# Altium schematic sheet Control_Schem.SchDoc (part 5 of 5)
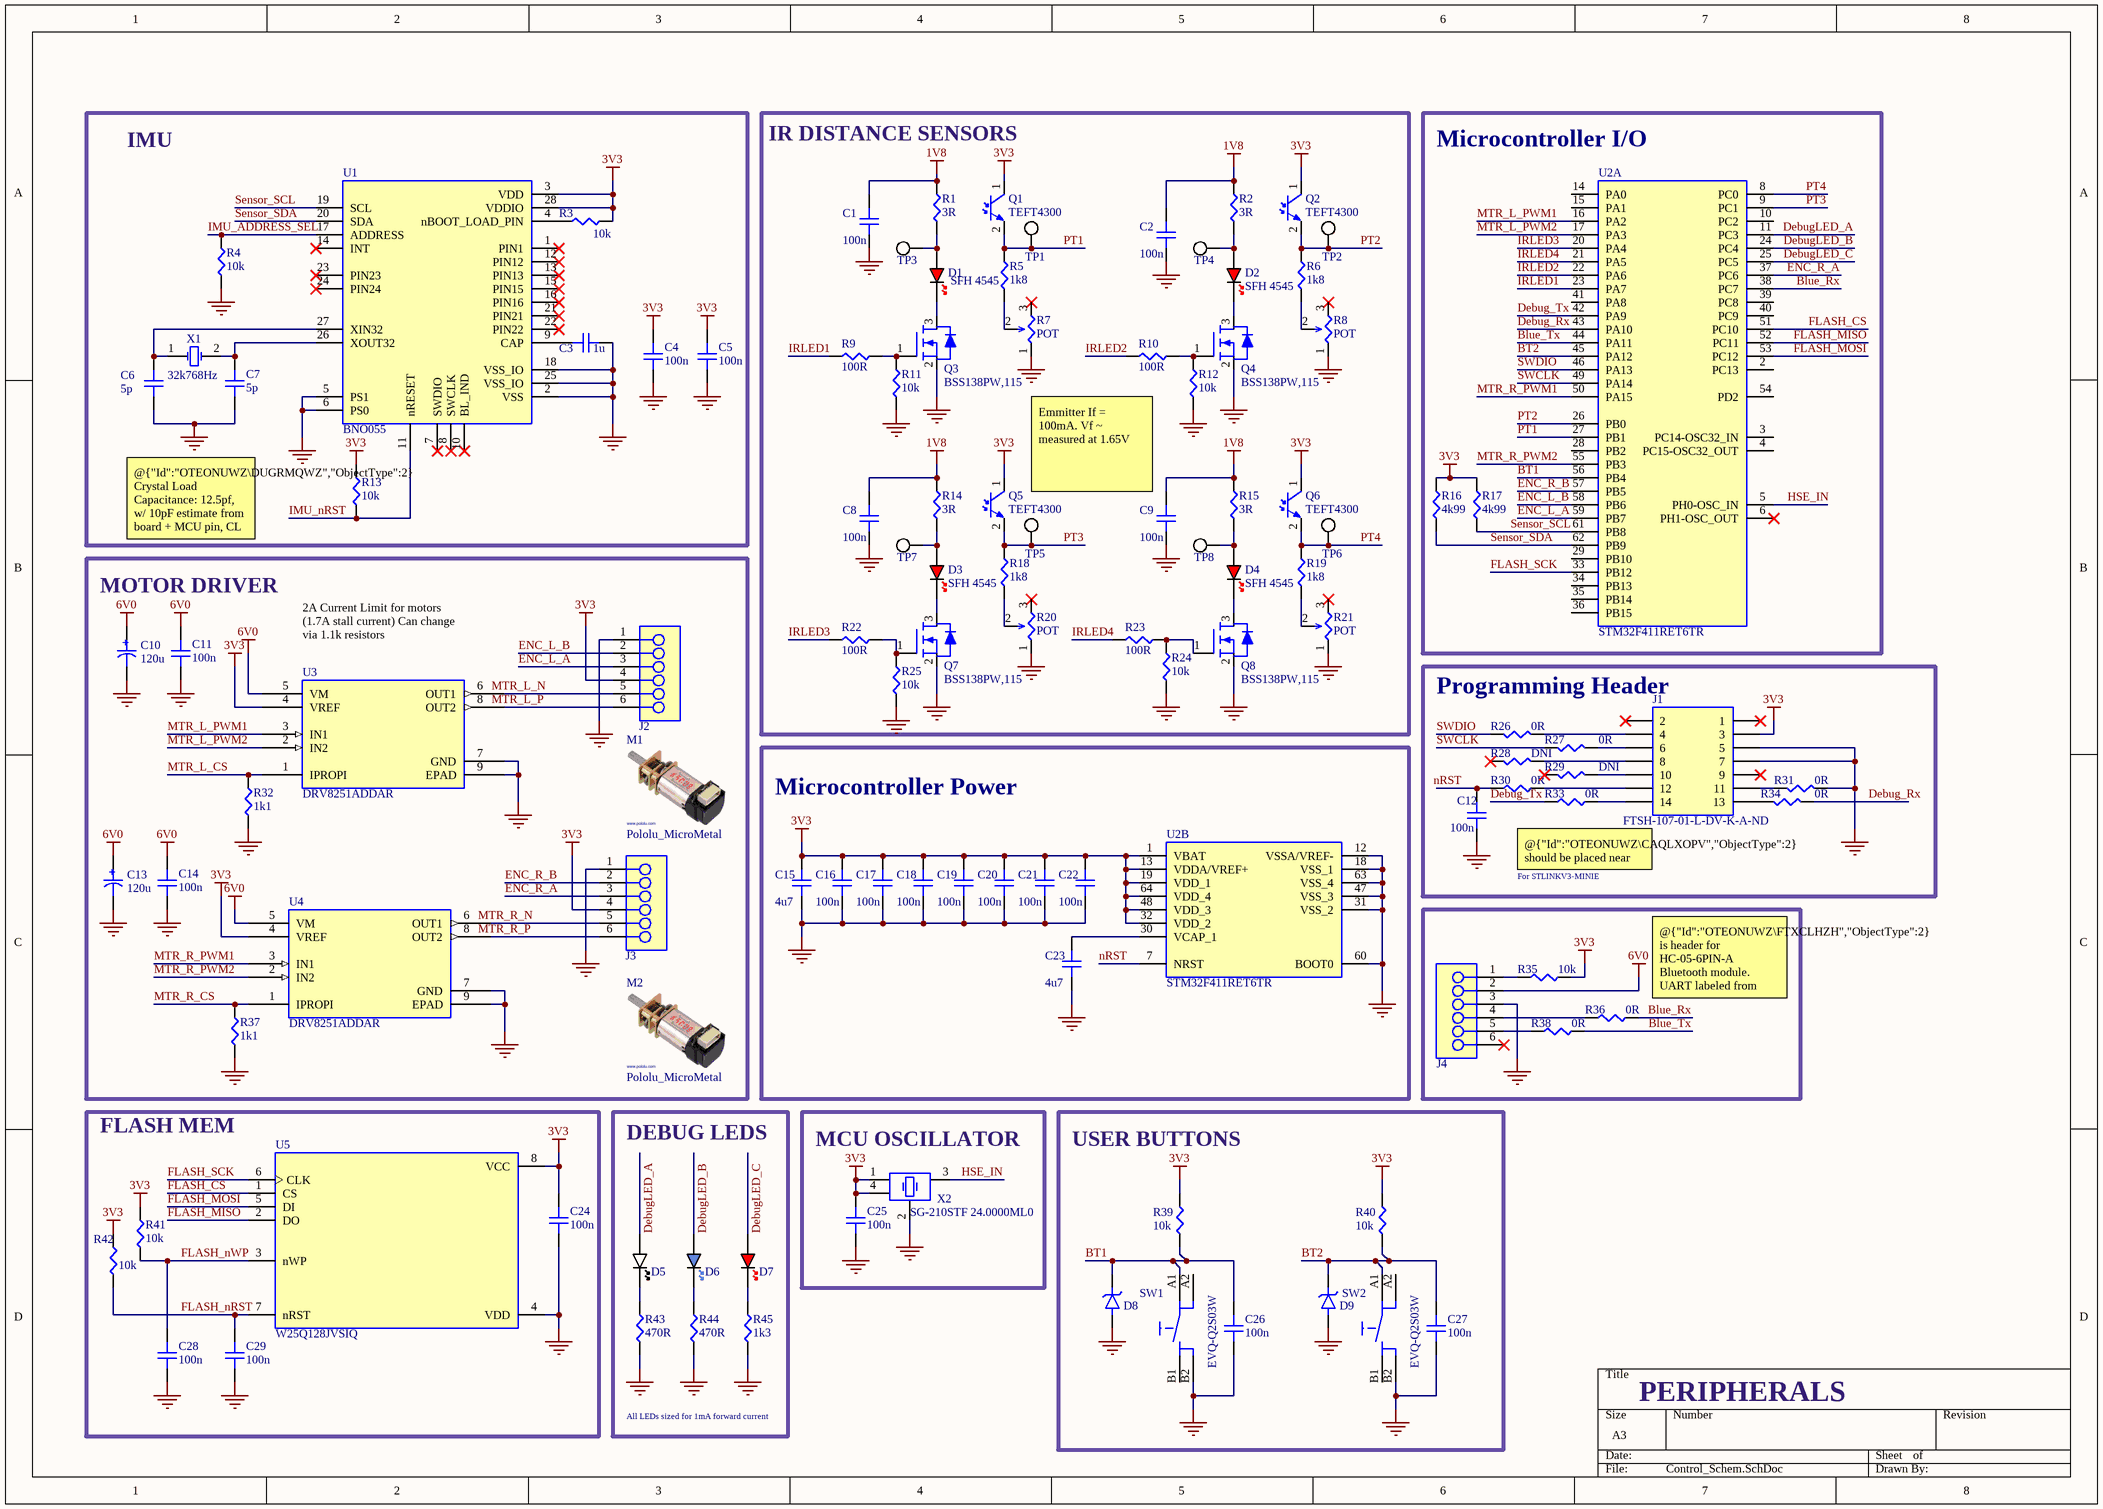
[diagram p4: Control_Schem.SchDoc]

## Library data of the parts (continued)
X2 = XTAL-4P: Oscillator XO 24MHz ±50ppm 15pF CMOS 55% 1.8V/2.5V/3.3V 4-Pin SMD T/R; Manufacturer: Epson; Fall Time: 3ns; Low Level Output Current: 6mA; Max Supply Current: 2.2mA; Max Supply Voltage: 3.3V; Min Supply Voltage: 1.6V; Ratings: IATF 16949; Supplier 1: Future Electronics; Supplier Part Number 1: SG-210STF 24.0000ML0; Manufacturer Part Number: SG-210STF 24.0000ML0; RoHS: Compliant; Category: Crystals; Stock: 1000; Pricing: 1000=0.335, 2000=0.325 (USD); Case/Package: SMD/SMT; China RoHS: Compliant; Country of Origin: Japan, Mainland China, Malaysia, Thailand; Export Control Classification Number (ECCN) Code: EAR99; Frequency: 24MHz; Frequency Stability: 50ppm; Height: 889µm; Introduction Date: 2014-01-28; Length: 2.4892mm; Lifecycle Status: Production; Load Capacitance: 15pF; Max Operating Temperature: 85°C; Min Operating Temperature: -40°C; Mounting Technology: Surface Mount; Number of Terminals: 4; Packaging: Tape & Reel (TR); REACH SVHC: Yes; Rise Time: 3ns; Schedule B: 8541600060, 8541600060|8541600060|8541600060|8541600060|8541600060; Width: 2.0066mm; ComponentLink1URL: https://datasheet.octopart.com:443/SG-210STF-24.0000ML0-Epson-datasheet-68297300.pdf?src-supplier=Electro+Sonic; ComponentLink1Description: https://datasheet.octopart.com:443/SG-210STF-24.0000ML0-Epson-datasheet-68297300.pdf?src-supplier=Electro+Sonic; ComponentLink2URL: https://datasheet.octopart.com:443/SG-210STF-24.0000ML0-Epson-datasheet-164319076.pdf?src-supplier=Arrow.cn; ComponentLink2Description: https://datasheet.octopart.com:443/SG-210STF-24.0000ML0-Epson-datasheet-164319076.pdf?src-supplier=Arrow.cn; ComponentLink3URL: https://datasheet.octopart.com:443/SG-210STF24.0000ML0-Epson-datasheet-189100305.pdf?src-supplier=Master+Electronics; ComponentLink3Description: https://datasheet.octopart.com:443/SG-210STF24.0000ML0-Epson-datasheet-189100305.pdf?src-supplier=Master+Electronics; ComponentLink4URL: http://sigma.octopart.com:80/149135108/reach_statement/Epson-SG-210STF-24.0000ML0.pdf?src-supplier=Compliance+Statements; ComponentLink4Description: http://sigma.octopart.com:80/149135108/reach_statement/Epson-SG-210STF-24.0000ML0.pdf?src-supplier=Compliance+Statements; ComponentLink5URL: http://sigma.octopart.com:80/149135109/rohs_statement/Epson-SG-210STF-24.0000ML0.pdf?src-supplier=Compliance+Statements; ComponentLink5Description: http://sigma.octopart.com:80/149135109/rohs_statement/Epson-SG-210STF-24.0000ML0.pdf?src-supplier=Compliance+Statements
J1 = STDC14_DebugConnector: Supplier 1: DigiKey